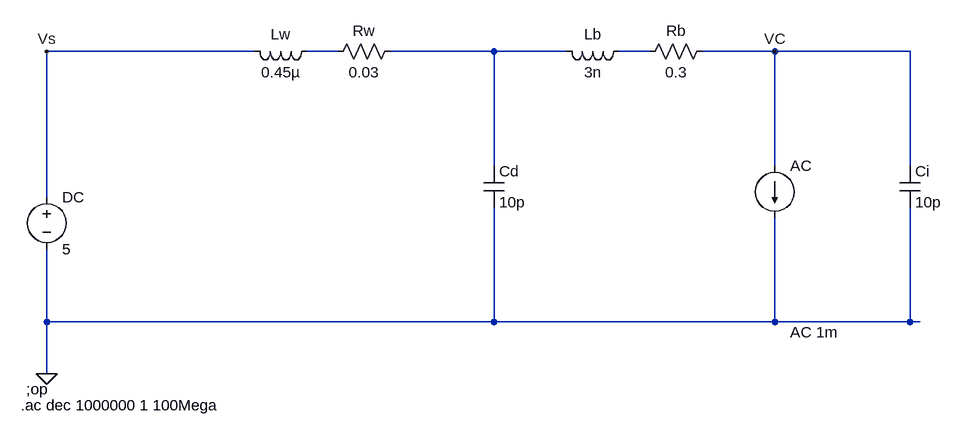
[diagram p0: schematic 2b.asc]
2b.asc, the LTspice schematic file:
Version 4
SHEET 1 880 680
WIRE -928 -176 -1248 -176
WIRE -800 -176 -848 -176
WIRE -560 -176 -720 -176
WIRE -448 -176 -560 -176
WIRE -320 -176 -368 -176
WIRE -128 -176 -240 -176
WIRE 80 -176 -128 -176
WIRE -560 0 -560 -176
WIRE -128 0 -128 -176
WIRE 80 0 80 -176
WIRE -1248 48 -1248 -176
WIRE -1248 240 -1248 128
WIRE -560 240 -560 64
WIRE -560 240 -1248 240
WIRE -128 240 -128 80
WIRE -128 240 -560 240
WIRE 80 240 80 64
WIRE 80 240 -128 240
WIRE 96 240 80 240
WIRE -1248 320 -1248 240
FLAG -1248 320 0
FLAG -128 -176 VC
FLAG -1248 -176 Vs
SYMBOL voltage -1248 32 R0
WINDOW 123 0 0 Left 0
WINDOW 39 0 0 Left 0
SYMATTR InstName DC
SYMATTR Value 5
SYMBOL ind -832 -192 R90
WINDOW 0 5 56 VBottom 0
WINDOW 3 32 56 VTop 0
SYMATTR InstName Lw
SYMATTR Value 0.45µ
SYMBOL res -704 -192 R90
WINDOW 0 0 56 VBottom 0
WINDOW 3 32 56 VTop 0
SYMATTR InstName Rw
SYMATTR Value 0.03
SYMBOL cap -576 0 R0
SYMATTR InstName Cd
SYMATTR Value 10p
SYMBOL ind -352 -192 R90
WINDOW 0 5 56 VBottom 0
WINDOW 3 32 56 VTop 0
SYMATTR InstName Lb
SYMATTR Value 3n
SYMBOL res -224 -192 R90
WINDOW 0 0 56 VBottom 0
WINDOW 3 32 56 VTop 0
SYMATTR InstName Rb
SYMATTR Value 0.3
SYMBOL cap 64 0 R0
SYMATTR InstName Ci
SYMATTR Value 10p
SYMBOL current -128 0 R0
WINDOW 3 24 228 Left 0
WINDOW 123 24 256 Left 0
WINDOW 39 24 284 Left 0
SYMATTR Value ""
SYMATTR Value2 AC 1m
SYMATTR InstName AC
TEXT -1280 344 Left 0 !;op
TEXT -1288 368 Left 0 !.ac dec 1000000 1 100Mega

The netlist it stands for:
* 2b.asc
V§DC Vs 0 5
Lw N001 Vs 0.45µ
Rw N002 N001 0.03
Cd N002 0 10p
Lb N003 N002 3n
Rb VC N003 0.3
Ci VC 0 10p
I§AC VC 0 AC 1m
;op
.ac dec 1000000 1 100Mega
.backanno
.end